# Altium schematic sheet M12_Sheet.SchDoc
size A3
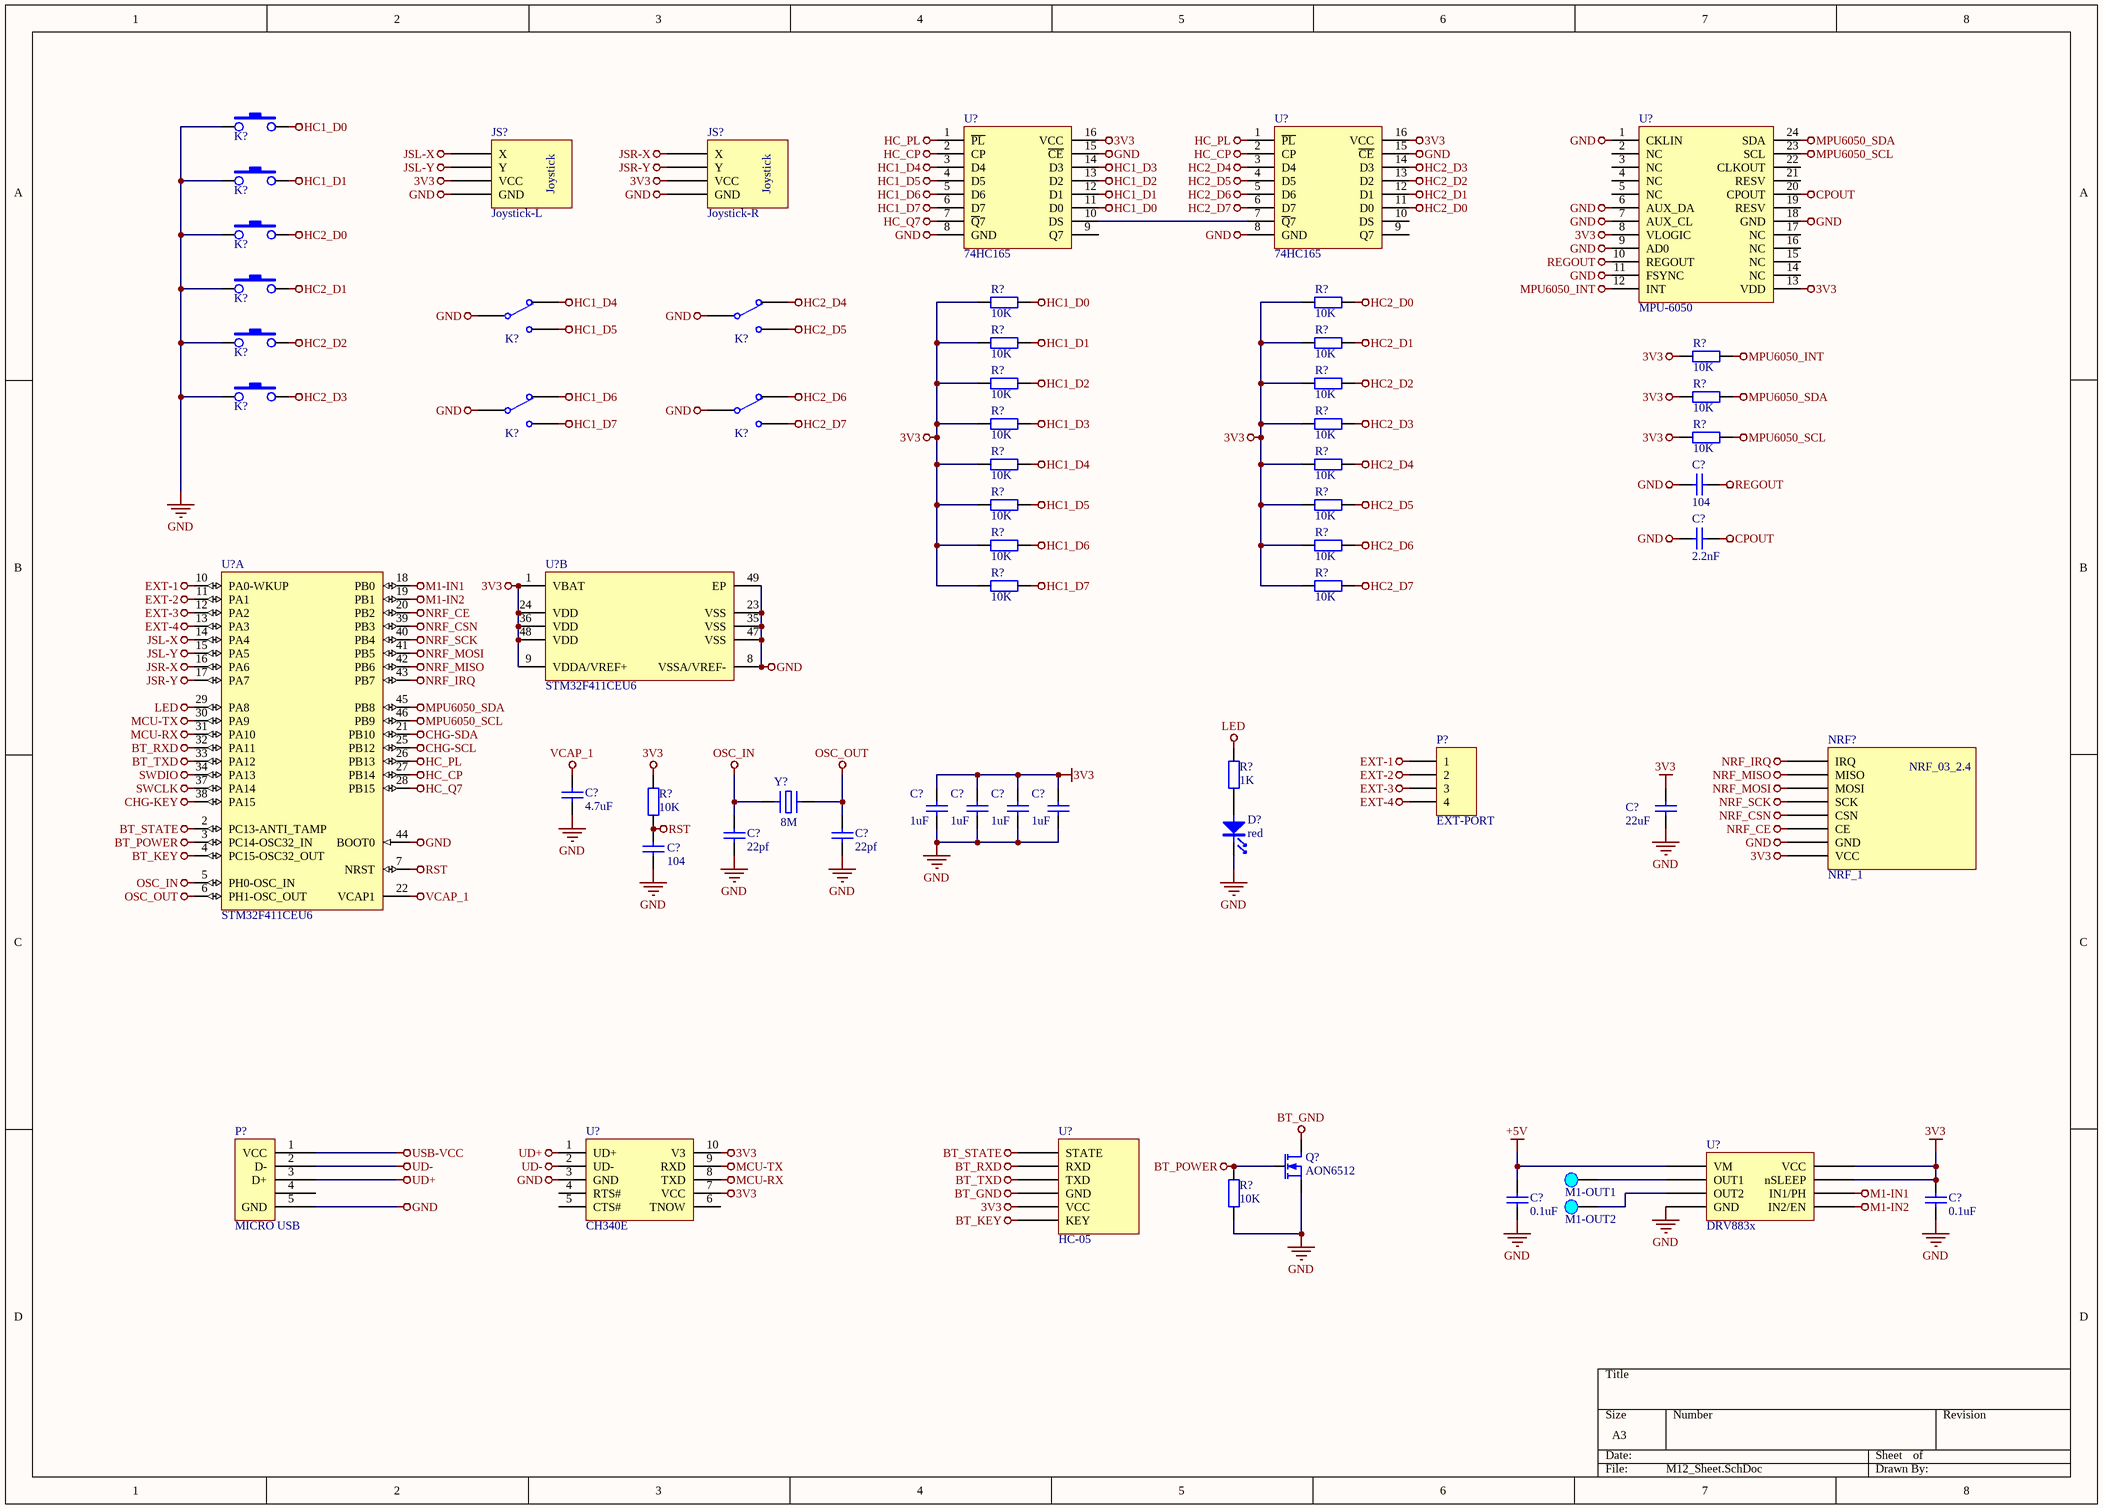
[diagram p0: M12_Sheet.SchDoc]

## Parts
(Parts that share a designator on the sheet are numbered #1, #2 ... from top to bottom, then left to right.)
C?#1  104  [电容_C0603]
C?#2  2.2nF  [电容_C0603]
C?#3  4.7uF  [电容_C0603]
C?#4  1uF  [电容_C0603]
C?#5  1uF  [电容_C0603]
C?#6  1uF  [电容_C0603]
C?#7  1uF  [电容_C0603]
C?#8  22uF  [电容_C1206]
C?#9  22pf  [电容_C0603]
C?#10  22pf  [电容_C0603]
C?#11  104  [电容_C0603]
C?#12  0.1uF  [电容_C0603]
C?#13  0.1uF  [电容_C0603]
D?  red  [LED_0603]
JS?#1  Joystick-L
JS?#2  Joystick-R
K?#1  SKRP  [开关按键_SKRP]  (value not drawn)
K?#2  SKRP  [开关按键_SKRP]  (value not drawn)
K?#3  SKRP  [开关按键_SKRP]  (value not drawn)
K?#4  SKRP  [开关按键_SKRP]  (value not drawn)
K?#5  *  [开关按键_K]  (value not drawn)
K?#6  *  [开关按键_K]  (value not drawn)
K?#7  SKRP  [开关按键_SKRP]  (value not drawn)
K?#8  SKRP  [开关按键_SKRP]  (value not drawn)
K?#9  *  [开关按键_K]  (value not drawn)
K?#10  *  [开关按键_K]  (value not drawn)
M?#1  M1-OUT1  [Pad_B]
M?#2  M1-OUT2  [Pad_B]
NRF?  NRF_1  [NRF-1]
P?#1  EXT-PORT  [HDR1X4]
P?#2  MICRO USB  [接插件_MICRO 牛角插座 USB 卷边]
Q?  AON6512  [MOS_SOT-23]
R?#1  10K  [电阻_R0603]
R?#2  10K  [电阻_R0603]
R?#3  10K  [电阻_R0603]
R?#4  10K  [电阻_R0603]
R?#5  10K  [电阻_R0603]
R?#6  10K  [电阻_R0603]
R?#7  10K  [电阻_R0603]
R?#8  10K  [电阻_R0603]
R?#9  10K  [电阻_R0603]
R?#10  10K  [电阻_R0603]
R?#11  10K  [电阻_R0603]
R?#12  10K  [电阻_R0603]
R?#13  10K  [电阻_R0603]
R?#14  10K  [电阻_R0603]
R?#15  10K  [电阻_R0603]
R?#16  10K  [电阻_R0603]
R?#17  10K  [电阻_R0603]
R?#18  10K  [电阻_R0603]
R?#19  10K  [电阻_R0603]
R?#20  1K  [电阻_R0603]
R?#21  10K  [电阻_R0603]
R?#22  10K  [电阻_R0603]
U?#1  74HC165  [74HC系列_SOP16]
U?#2  74HC165  [74HC系列_SOP16]
U?#3  MPU-6050  [陀螺仪_QFN24]
U?#4  STM32F411CEU6  [STM-UFQFPN48_N]  (part A of 2)
U?#5  STM32F411CEU6  [STM-UFQFPN48_N]  (part B of 2)
U?#6  CH340E  [串口_MSOP10]
U?#7  DRV883x  [WSON-8]
U?#8  HC-05  [HDR1X6]
Y?  F: 8M  [晶振_2016]  (hidden comment: XTAL)

## Nets
3V3: C?#4.2 C?#5.2 C?#6.2 C?#7.2 C?#8.2 C?#13.2 JS?#1.2(VCC) JS?#2.2(VCC) NRF?.1(VCC) R?#1.1 R?#2.1 R?#3.1 R?#4.1 R?#5.2 R?#6.1 R?#7.1 R?#8.2 R?#9.1 R?#10.1 R?#11.2 R?#12.1 R?#13.1 R?#14.1 R?#15.1 R?#16.1 R?#17.1 R?#18.1 R?#19.1 R?#21.2 U?#1.16(VCC) U?#2.16(VCC) U?#3.8(VLOGIC) U?#3.13(VDD) U?#5.1(VBAT) U?#5.9(VDDA/VREF+) U?#5.24(VDD) U?#5.36(VDD) U?#5.48(VDD) U?#6.7(VCC) U?#6.10(V3) U?#7.7(nSLEEP) U?#7.8(VCC) U?#8.2(VCC)
+5V: C?#12.1 U?#7.1(VM)
BT_GND: Q?.2(D) U?#8.3(GND)
BT_KEY: U?#4.4(PC15-OSC32_OUT) U?#8.1(KEY)
BT_POWER: Q?.1(G) R?#22.2 U?#4.3(PC14-OSC32_IN)
BT_RXD: U?#4.32(PA11) U?#8.5(RXD)
BT_STATE: U?#4.2(PC13-ANTI_TAMP) U?#8.6(STATE)
BT_TXD: U?#4.33(PA12) U?#8.4(TXD)
CHG-KEY: U?#4.38(PA15)
CHG-SCL: U?#4.25(PB12)
CHG-SDA: U?#4.21(PB10)
CPOUT: C?#2.2 U?#3.20(CPOUT)
EXT-1: P?#1.1 U?#4.10(PA0-WKUP)
EXT-2: P?#1.2 U?#4.11(PA1)
EXT-3: P?#1.3 U?#4.12(PA2)
EXT-4: P?#1.4 U?#4.13(PA3)
GND: C?#1.1 C?#2.1 C?#3.1 C?#4.1 C?#5.1 C?#6.1 C?#7.1 C?#8.1 C?#9.2 C?#10.2 C?#11.1 C?#12.2 C?#13.1 D?.K JS?#1.1(GND) JS?#2.1(GND) K?#1.1 K?#2.1 K?#3.1 K?#4.1 K?#5.1 K?#6.1 K?#7.1 K?#8.1 K?#9.1 K?#10.1 NRF?.2(GND) P?#2.0 P?#2.5(GND) Q?.3(S) R?#22.1 U?#1.8(GND) U?#1.15(~{CE}) U?#2.8(GND) U?#2.15(~{CE}) U?#3.0 U?#3.1(CKLIN) U?#3.6(AUX_DA) U?#3.7(AUX_CL) U?#3.9(AD0) U?#3.11(FSYNC) U?#3.18(GND) U?#4.44(BOOT0) U?#5.8(VSSA/VREF-) U?#5.23(VSS) U?#5.35(VSS) U?#5.47(VSS) U?#5.49(EP) U?#6.3(GND) U?#7.4(GND)
HC1_D0: K?#1.2 R?#1.2 U?#1.11(D0)
HC1_D1: K?#2.2 R?#3.2 U?#1.12(D1)
HC1_D2: R?#6.2 U?#1.13(D2)
HC1_D3: R?#9.2 U?#1.14(D3)
HC1_D4: K?#5.2 R?#12.2 U?#1.3(D4)
HC1_D5: K?#5.3 R?#14.2 U?#1.4(D5)
HC1_D6: K?#9.2 R?#16.2 U?#1.5(D6)
HC1_D7: K?#9.3 R?#18.2 U?#1.6(D7)
HC2_D0: K?#3.2 R?#2.2 U?#2.11(D0)
HC2_D1: K?#4.2 R?#4.2 U?#2.12(D1)
HC2_D2: K?#7.2 R?#7.2 U?#2.13(D2)
HC2_D3: K?#8.2 R?#10.2 U?#2.14(D3)
HC2_D4: K?#6.2 R?#13.2 U?#2.3(D4)
HC2_D5: K?#6.3 R?#15.2 U?#2.4(D5)
HC2_D6: K?#10.2 R?#17.2 U?#2.5(D6)
HC2_D7: K?#10.3 R?#19.2 U?#2.6(D7)
HC_CP: U?#1.2(CP) U?#2.2(CP) U?#4.27(PB14)
HC_PL: U?#1.1(~{PL}) U?#2.1(~{PL}) U?#4.26(PB13)
HC_Q7: U?#1.7(~{Q}7) U?#4.28(PB15)
JSL-X: JS?#1.4(X) U?#4.14(PA4)
JSL-Y: JS?#1.3(Y) U?#4.15(PA5)
JSR-X: JS?#2.4(X) U?#4.16(PA6)
JSR-Y: JS?#2.3(Y) U?#4.17(PA7)
LED: R?#20.1 U?#4.29(PA8)
M1-IN1: U?#4.18(PB0) U?#7.6(IN1/PH)
M1-IN2: U?#4.19(PB1) U?#7.5(IN2/EN)
MCU-RX: U?#4.31(PA10) U?#6.8(TXD)
MCU-TX: U?#4.30(PA9) U?#6.9(RXD)
MPU6050_INT: R?#5.1 U?#3.12(INT)
MPU6050_SCL: R?#11.1 U?#3.23(SCL) U?#4.46(PB9)
MPU6050_SDA: R?#8.1 U?#3.24(SDA) U?#4.45(PB8)
NRF_CE: NRF?.3(CE) U?#4.20(PB2)
NRF_CSN: NRF?.4(CSN) U?#4.39(PB3)
NRF_IRQ: NRF?.8(IRQ) U?#4.43(PB7)
NRF_MISO: NRF?.7(MISO) U?#4.42(PB6)
NRF_MOSI: NRF?.6(MOSI) U?#4.41(PB5)
NRF_SCK: NRF?.5(SCK) U?#4.40(PB4)
OSC_IN: C?#9.1 U?#4.5(PH0-OSC_IN) Y?.1
OSC_OUT: C?#10.1 U?#4.6(PH1-OSC_OUT) Y?.2
REGOUT: C?#1.2 U?#3.10(REGOUT)
RST: C?#11.2 R?#21.1 U?#4.7(NRST)
SWCLK: U?#4.37(PA14)
SWDIO: U?#4.34(PA13)
UD+: P?#2.3(D+) U?#6.1(UD+)
UD-: P?#2.2(D-) U?#6.2(UD-)
USB-VCC: P?#2.1(VCC)
VCAP_1: C?#3.2 U?#4.22(VCAP1)
NetD?_A: D?.A R?#20.2
NetM?#1_1: M?#1.1 U?#7.2(OUT1)
NetM?#2_1: M?#2.1 U?#7.3(OUT2)
NetU?#1_10: U?#1.10(DS) U?#2.7(~{Q}7)

Not connected (* = marked no-connect by the designer): P?#2 4; U?#1 9(Q7); U?#2 9(Q7) 10(DS); U?#3 2(NC) 3(NC) 4(NC) 5(NC) 14(NC) 15(NC) 16(NC) 17(NC) 19(RESV) 21(RESV) 22(CLKOUT); U?#6 4(RTS#) 5(CTS#) 6(TNOW)

## Notes on the sheet
- (in symbol NRF_1) NRF_03_2.4

## Library data of the parts
C?#1-C?#13 = cap: U: 50V; 参数: Cap,0805,X7R,104K,50V,125C,±10%
  C?#1 C?#11: C: 104
  C?#2: C: 2.2nF
  C?#3: C: 4.7uF
  C?#4-C?#7: C: 1uF
  C?#8: C: 22uF
  C?#9 C?#10: C: 22pf
  C?#12 C?#13: C: 0.1uF
D? = LED: 参数: LED,0603,Red
JS?#1 JS?#2 = Joystick
K?#1-K?#4 K?#7 K?#8 = SW-PB: _Comma: ,; _Name: KEY; _Specification: KEY,SKRP,*; _Footprint: *; _Model: SKRP
K?#5 K?#6 K?#9 K?#10 = KEY-3: _Comma: ,; _Footprint: KEY-3*6; _Name: Switch; _Specification: Switch,*,KEY-3*6; _Model: *
M?#1 = Pad: _Funcyusa: Test; _Specification: Pad,Test,M1-OUT1; _Comma: ,; _Name: Pad; _Remarks: M1-OUT1
M?#2 = Pad: _Funcyusa: Test; _Specification: Pad,Test,M1-OUT2; _Comma: ,; _Name: Pad; _Remarks: M1-OUT2
P?#1 = Header 4: Header, 4-Pin; LatestRevisionDate: 17-Jul-2002; LatestRevisionNote: Re-released for DXP Platform.; Publisher: Altium Limited
P?#2 = MICRO USB 5PIN: _Comma: ,; _Name: Port; _Specification: Port,MICRO USB,5PIN; _Value: 5PIN; _Model: MICRO USB
Q? = MOSFET-N: 参数: N-MOSFET,DFN5*6,AON6512,30V,150A
R?#1-R?#22 = Res: P: 1/8W; 参数: Res,0805,0R,±1%,1/8W,100ppm,155C
  R?#1-R?#19 R?#21 R?#22: R: 10K
  R?#20: R: 1K
U?#4 U?#5 = STM32F401CCU6: ARM Cortex-M4 32-bit MCU+FPU, 105 DMIPS, 256 kB Flash, 64 kB Internal RAM, 36 I/Os, 48-pin UFQFPN, -40 to 85 degC, Tray; Manufacturer: STMicroelectronics; FLASH Size (Prog) (kB): 256; I/Os (High Current): 36; Internal RAM Size (kB): 64; Operating Frequency(F) (Processor speed) (MHz): 84; Supply Voltage(Vcc) max (V): 3.6; Supply Voltage(Vcc) min (V): 1.8; DatasheetVersion: Rev. 1; PackageVersion: Rev. 1, 04/2013; PackageReference: UFQFPN48; PackageDescription: 48-Pin Ultra Thin Fine Pitch Quad Flat No-Lead, 7 x 7 x 0.6 mm Body, 0.5 mm Pitch, Exposed Pad; Supplier 1: Newark; Supplier Part Number 1: 19X6217; Supplier 2: Mouser; Supplier Part Number 2: 511-STM32F401CCU6; Core: ARM Cortex-M4; Packing: Tray; Mounting Technology: Surface Mount; PartNumber: STM32F401CCU6; ComponentLink1Description: Manufacturer URL; ComponentLink1URL: http://www.st.com/web/en/home.html; ComponentLink2Description: Datasheet; ComponentLink2URL: http://www.st.com/st-web-ui/static/active/en/resource/technical/document/data_brief/DM00071938.pdf; ComponentLink3Description: Package Specification; ComponentLink3URL: http://www.st.com/st-web-ui/static/active/en/resource/technical/document/data_brief/DM00071938.pdf
U?#8 = HC-05: Bluetooth